# EAGLE schematic BoardV1 (EAGLE 9.3.0)
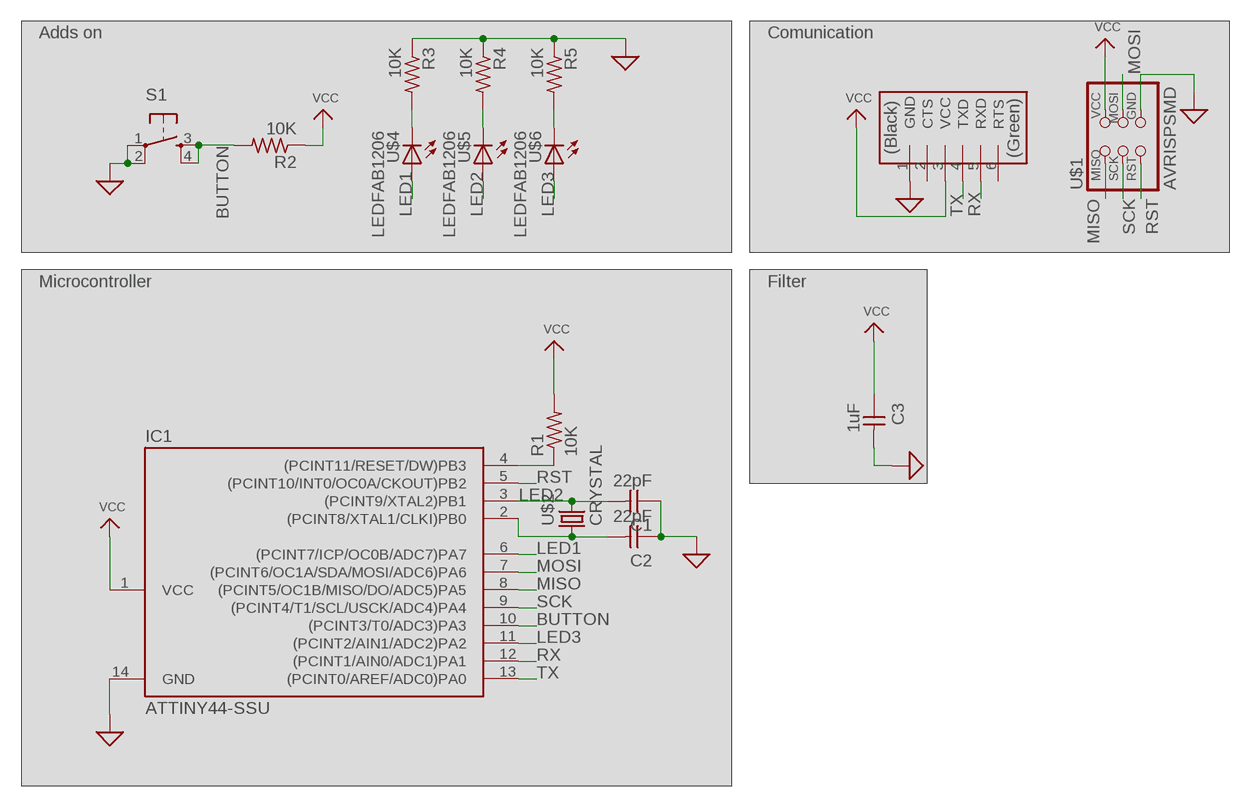
[diagram p0: schematic, sheet 1]

## Parts
C1  22pF  CAP-UNPOLARIZEDFAB  [C1206FAB]
C2  22pF  CAP-UNPOLARIZEDFAB  [C1206FAB]
C3  1uF  CAP-UNPOLARIZEDFAB  [C1206FAB]
IC1  ATTINY44-SSU  [SOIC14]
R1  10K  RES-US1206W  [R1206W]
R2  10K  RES-US1206W  [R1206W]
R3  10K  RES-US1206W  [R1206W]
R4  10K  RES-US1206W  [R1206W]
R5  10K  RES-US1206W  [R1206W]
S1  6MM_SWITCH6MM_SWITCH  [6MM_SWITCH]
U$1  AVRISPSMD  [2X03SMD]
U$2  CRYSTAL  [2-SMD-5X3MM]
U$3  FTDI-SMD-HEADER  [1X06SMD]
U$4  LEDFAB1206  [LED1206FAB]
U$5  LEDFAB1206  [LED1206FAB]
U$6  LEDFAB1206  [LED1206FAB]

## Nets
BUTTON: IC1.10((PCINT3/T0/ADC3)PA3) R2.2 S1.3(S) S1.4(S1)
GND: C1.1 C2.1 C3.2 IC1.14(GND) R3.1 R4.1 R5.1 S1.1(P) S1.2(P1) U$1.6(GND) U$3.1(GND) ; supply symbol labelled SUP
LED1: IC1.6((PCINT7/ICP/OC0B/ADC7)PA7) U$4.1(A)
LED2: IC1.5((PCINT10/INT0/OC0A/CKOUT)PB2) U$5.1(A)
LED3: IC1.11((PCINT2/AIN1/ADC2)PA2) U$6.1(A)
MISO: IC1.8((PCINT5/OC1B/MISO/DO/ADC5)PA5) U$1.1(MISO)
MOSI: IC1.7((PCINT6/OC1A/SDA/MOSI/ADC6)PA6) U$1.4(MOSI)
N$2: C1.2 IC1.3((PCINT9/XTAL2)PB1) U$2.P$2
N$3: C2.2 IC1.2((PCINT8/XTAL1/CLKI)PB0) U$2.P$1
N$6: R3.2 U$4.2(C)
N$8: R4.2 U$5.2(C)
N$10: R5.2 U$6.2(C)
RST: IC1.4((PCINT11/RESET/DW)PB3) R1.1 U$1.5(RST)
RX: IC1.12((PCINT1/AIN0/ADC1)PA1) U$3.5(RXD)
SCK: IC1.9((PCINT4/T1/SCL/USCK/ADC4)PA4) U$1.3(SCK)
TX: IC1.13((PCINT0/AREF/ADC0)PA0) U$3.4(TXD)
VCC: C3.1 IC1.1(VCC) R1.2 R2.1 U$1.2(VCC) U$3.3(VCC)
Unconnected: U$3.2(CTS) U$3.6(RTS)

## Notes on the sheet
- Adds on | Comunication
- Microcontroller | Filter

## Library data of the parts
C1-C3 = fabAca:CAP-UNPOLARIZED
IC1 = fabAca:ATTINY44
R1-R5 = fabAca:RES-US: Resistor (US Symbol) Variants with postfix FAB are widened to allow the routing of internal traces
S1 = fabAca:6MM_SWITCH: OMRON SWITCH; SPICEPREFIX: S
U$1 = fabAca:AVRISP
U$2 = fabAca:CRYSTAL
U$3 = fabAca:FTDI-SMD-HEADER
U$4-U$6 = fabAca:LED: LED